# Altium schematic sheet Microprocessor.SchDoc
size B; SheetNumber: 2; SheetTotal: 2
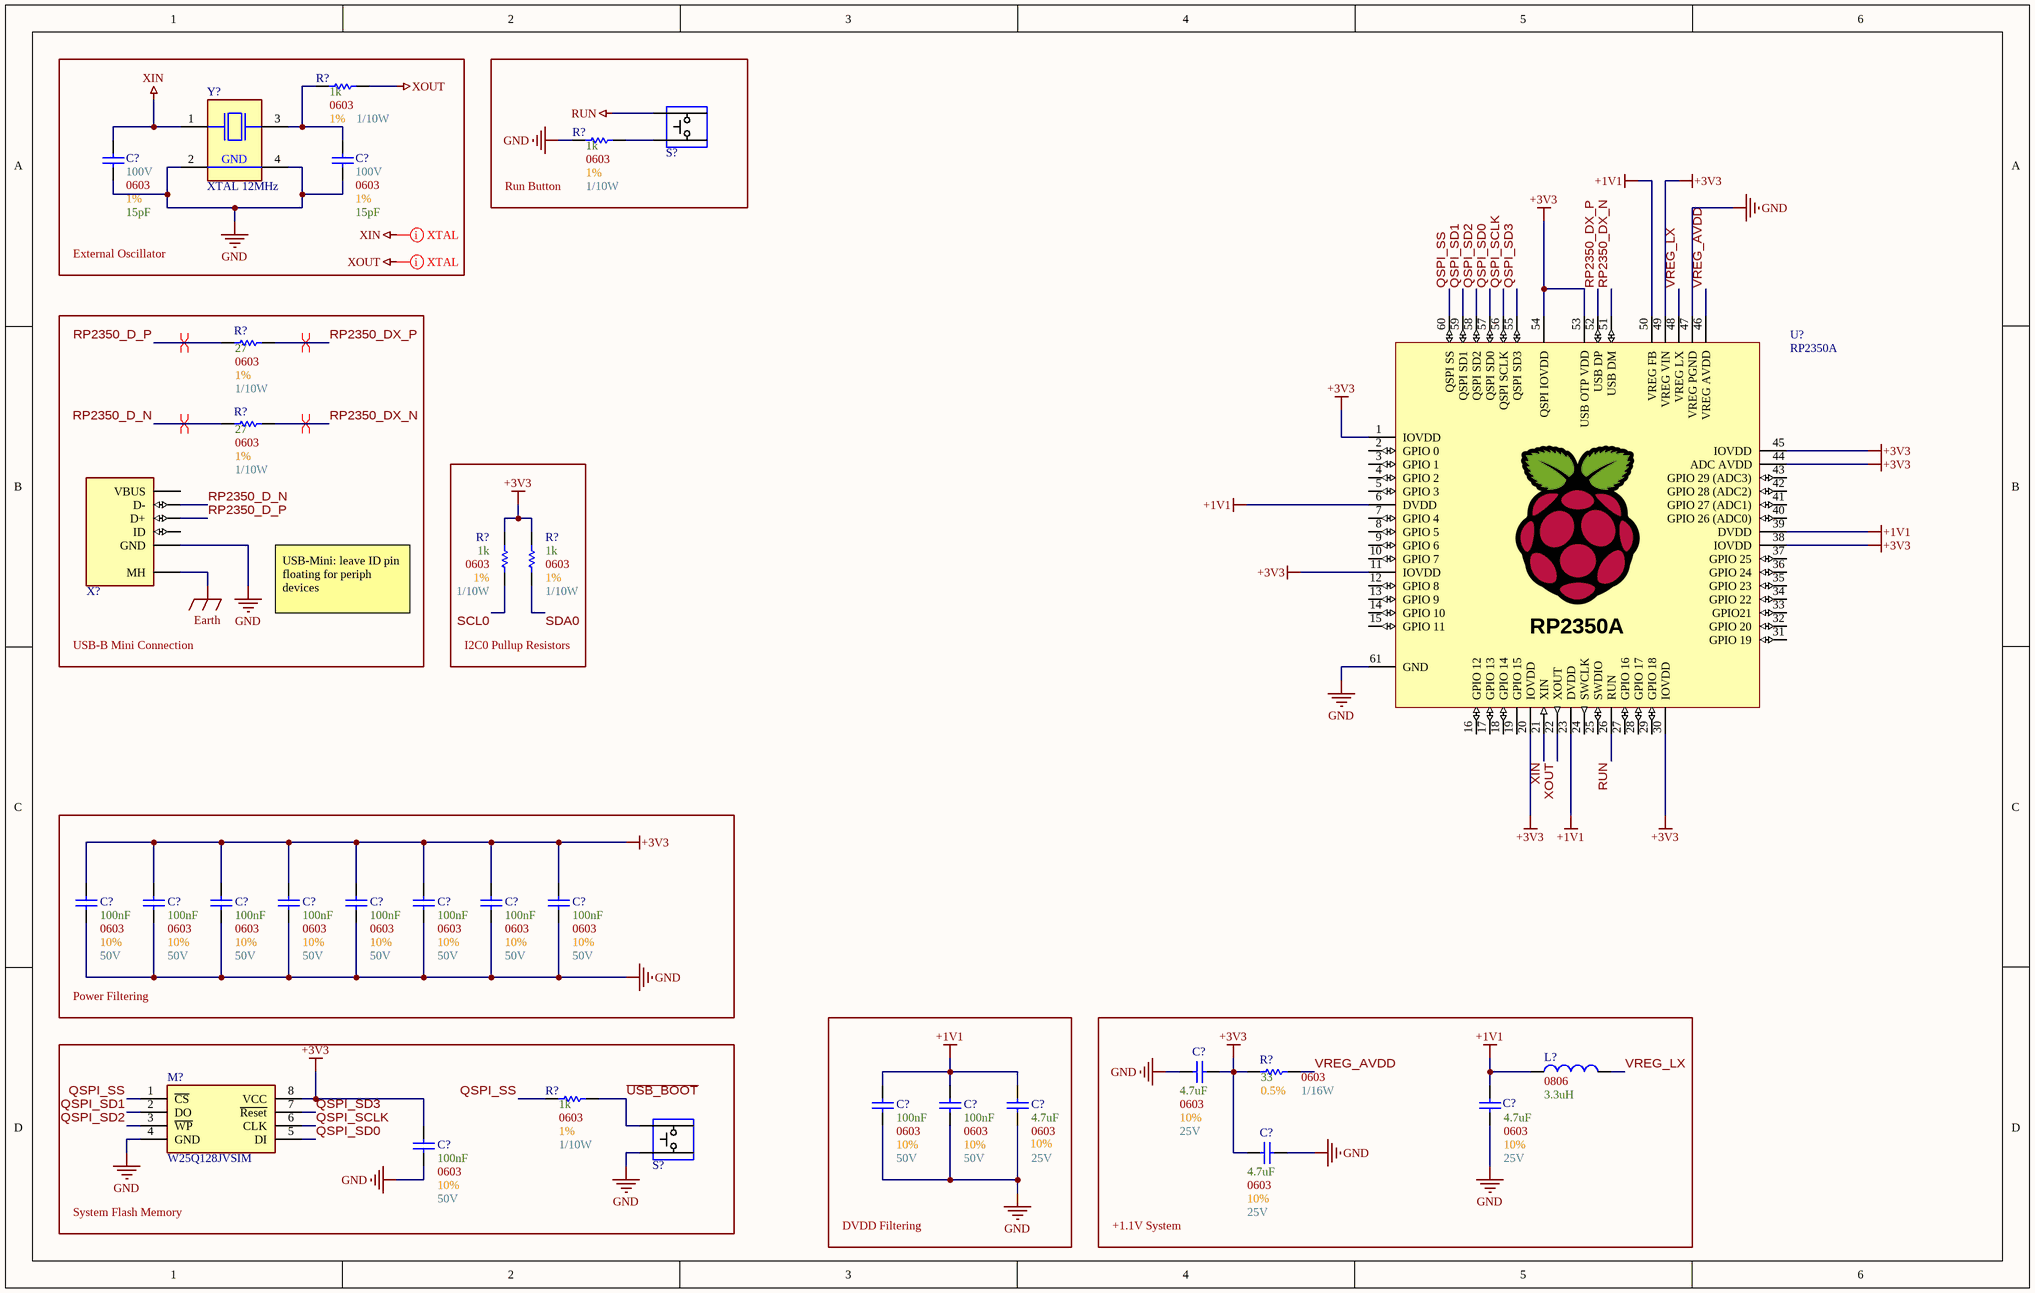
[diagram p0: Microprocessor.SchDoc]

## Parts
(Parts that share a designator on the sheet are numbered #1, #2 ... from top to bottom, then left to right.)
C?#1  Max Voltage: 100V  Size Package: 0603  Tolerance: 1%  Capacitance: 15pF  [[Cap] SMD 0603]  (hidden comment: [Cap] 0603 15pF 1% 100V)
C?#2  Max Voltage: 100V  Size Package: 0603  Tolerance: 1%  Capacitance: 15pF  [[Cap] SMD 0603]  (hidden comment: [Cap] 0603 15pF 1% 100V)
C?#3  Max Voltage: 50V  Size Package: 0603  Tolerance: 10%  Capacitance: 100nF  [[Cap] SMD 0603]  (hidden comment: [Cap] 0603 0.1uF 10% 50V)
C?#4  Max Voltage: 50V  Size Package: 0603  Tolerance: 10%  Capacitance: 100nF  [[Cap] SMD 0603]  (hidden comment: [Cap] 0603 0.1uF 10% 50V)
C?#5  Max Voltage: 50V  Size Package: 0603  Tolerance: 10%  Capacitance: 100nF  [[Cap] SMD 0603]  (hidden comment: [Cap] 0603 0.1uF 10% 50V)
C?#6  Max Voltage: 50V  Size Package: 0603  Tolerance: 10%  Capacitance: 100nF  [[Cap] SMD 0603]  (hidden comment: [Cap] 0603 0.1uF 10% 50V)
C?#7  Max Voltage: 50V  Size Package: 0603  Tolerance: 10%  Capacitance: 100nF  [[Cap] SMD 0603]  (hidden comment: [Cap] 0603 0.1uF 10% 50V)
C?#8  Max Voltage: 50V  Size Package: 0603  Tolerance: 10%  Capacitance: 100nF  [[Cap] SMD 0603]  (hidden comment: [Cap] 0603 0.1uF 10% 50V)
C?#9  Max Voltage: 50V  Size Package: 0603  Tolerance: 10%  Capacitance: 100nF  [[Cap] SMD 0603]  (hidden comment: [Cap] 0603 0.1uF 10% 50V)
C?#10  Max Voltage: 50V  Size Package: 0603  Tolerance: 10%  Capacitance: 100nF  [[Cap] SMD 0603]  (hidden comment: [Cap] 0603 0.1uF 10% 50V)
C?#11  Max Voltage: 25V  Size Package: 0603  Tolerance: 10%  Capacitance: 4.7uF  [[Cap] SMD 0603]  (hidden comment: [Cap] 0603 4.7uF 10% 25V)
C?#12  Max Voltage: 25V  Size Package: 0603  Tolerance: 10%  Capacitance: 4.7uF  [[Cap] SMD 0603]  (hidden comment: [Cap] 0603 4.7uF 10% 25V)
C?#13  Max Voltage: 50V  Size Package: 0603  Tolerance: 10%  Capacitance: 100nF  [[Cap] SMD 0603]  (hidden comment: [Cap] 0603 0.1uF 10% 50V)
C?#14  Max Voltage: 50V  Size Package: 0603  Tolerance: 10%  Capacitance: 100nF  [[Cap] SMD 0603]  (hidden comment: [Cap] 0603 0.1uF 10% 50V)
C?#15  Max Voltage: 25V  Size Package: 0603  Tolerance: 10%  Capacitance: 4.7uF  [[Cap] SMD 0603]  (hidden comment: [Cap] 0603 4.7uF 10% 25V)
C?#16  Max Voltage: 25V  Size Package: 0603  Tolerance: 10%  Capacitance: 4.7uF  [[Cap] SMD 0603]  (hidden comment: [Cap] 0603 4.7uF 10% 25V)
C?#17  Max Voltage: 50V  Size Package: 0603  Tolerance: 10%  Capacitance: 100nF  [[Cap] SMD 0603]  (hidden comment: [Cap] 0603 0.1uF 10% 50V)
L?  Package: 0806  Inductance: 3.3uH  [[Inductor] SMD 0806]  (hidden comment: [3.3uH] SMD 0806 2.1A)
M?  W25Q128JVSIM  [[Flash] 128MBit]
R?#1  Wattage: 1/10W  Tolerance: 1%  Resistance: 1k  Size Package: 0603  [[Res] SMD 0603]  (hidden comment: [1k] SMD 0603 1% 1/10W)
R?#2  Wattage: 1/10W  Tolerance: 1%  Resistance: 1k  Size Package: 0603  [[Res] SMD 0603]  (hidden comment: [1k] SMD 0603 1% 1/10W)
R?#3  Wattage: 1/10W  Tolerance: 1%  Resistance: 27  Size Package: 0603  [[Res] SMD 0603]  (hidden comment: [27] SMD 0603 1% 1/10W)
R?#4  Wattage: 1/10W  Tolerance: 1%  Resistance: 27  Size Package: 0603  [[Res] SMD 0603]  (hidden comment: [27] SMD 0603 1% 1/10W)
R?#5  Wattage: 1/10W  Tolerance: 1%  Resistance: 1k  Size Package: 0603  [[Res] SMD 0603]  (hidden comment: [1k] SMD 0603 1% 1/10W)
R?#6  Wattage: 1/10W  Tolerance: 1%  Resistance: 1k  Size Package: 0603  [[Res] SMD 0603]  (hidden comment: [1k] SMD 0603 1% 1/10W)
R?#7  Wattage: 1/16W  Tolerance: 0.5%  Resistance: 33  Size Package: 0603  [[Res] SMD 0603]  (hidden comment: [33] SMD 0603 0.5% 1/16W)
R?#8  Wattage: 1/10W  Tolerance: 1%  Resistance: 1k  Size Package: 0603  [[Res] SMD 0603]  (hidden comment: [1k] SMD 0603 1% 1/10W)
S?#1  Standard pushbutton  [[SPST] Pushbutton]  (value not drawn)
S?#2  Standard pushbutton  [[SPST] Pushbutton]  (value not drawn)
U?  RP2350A  [[MCU] RP2350A]
X?  [USB] Type-B Mini  [[USB] Type-B Mini]  (value not drawn)
Y?  XTAL 12MHz  [[Crystal] SMD 12MHz]

## Blocks framed on the sheet
External Oscillator: C?#1 C?#2 R?#1 Y?
Run Button: R?#2 S?#1
USB-B Mini Connection: R?#3 R?#4 X?
I2C0 Pullup Resistors: R?#5 R?#6
Power Filtering: C?#3-C?#10
DVDD Filtering: C?#13-C?#15
+1.1V System: C?#11 C?#12 C?#16 L? R?#7
System Flash Memory: C?#17 M? R?#8 S?#2

## Nets
+1V1: C?#12.1 C?#13.2 C?#14.2 C?#15.2 L?.1 U?.6(DVDD) U?.23(DVDD) U?.39(DVDD) U?.50(VREG_FB)
+3V3: C?#3.2 C?#4.2 C?#5.2 C?#6.2 C?#7.2 C?#8.2 C?#9.2 C?#10.2 C?#11.1 C?#16.2 C?#17.2 M?.8(VCC) R?#5.2 R?#6.2 R?#7.1 U?.1(IOVDD) U?.11(IOVDD) U?.20(IOVDD) U?.30(IOVDD) U?.38(IOVDD) U?.44(ADC_AVDD) U?.45(IOVDD) U?.49(VREG_VIN) U?.53(USB_OTP_VDD) U?.54(QSPI_IOVDD)
Earth: X?.MH
GND: C?#1.1 C?#2.1 C?#3.1 C?#4.1 C?#5.1 C?#6.1 C?#7.1 C?#8.1 C?#9.1 C?#10.1 C?#11.2 C?#12.2 C?#13.1 C?#14.1 C?#15.1 C?#16.1 C?#17.1 M?.4(GND) R?#2.1 S?#2.2 U?.47(VREG_PGND) U?.61(GND) X?.5(GND) Y?.2(GND) Y?.4(GND)
RUN: S?#1.1 U?.26(RUN)
XIN: C?#1.2 U?.21(XIN) Y?.1(XTAL1)
XOUT: R?#1.2 U?.22(XOUT)
QSPI_SCLK: M?.6(CLK) U?.56(QSPI_SCLK)
QSPI_SD0: M?.5(DI) U?.57(QSPI_SD0)
QSPI_SD1: M?.2(DO) U?.59(QSPI_SD1)
QSPI_SD2: M?.3(~{WP}) U?.58(QSPI_SD2)
QSPI_SD3: M?.7(~{Reset}) U?.55(QSPI_SD3)
QSPI_SS: M?.1(~{CS}) R?#8.1 U?.60(QSPI_SS)
RP2350_D_N: R?#4.1 X?.2(D-)
RP2350_D_P: R?#3.1 X?.3(D+)
RP2350_DX_N: R?#4.2 U?.51(USB_DM)
RP2350_DX_P: R?#3.2 U?.52(USB_DP)
SCL0: R?#5.1
SDA0: R?#6.1
~{USB_BOOT}: R?#8.2 S?#2.1
VREG_AVDD: R?#7.2 U?.46(VREG_AVDD)
VREG_LX: L?.2 U?.48(VREG_LX)
NetC?#2_2: C?#2.2 R?#1.1 Y?.3(XTAL2)
NetR?#2_2: R?#2.2 S?#1.2

Not connected (* = marked no-connect by the designer): U? 2(GPIO_0) 3(GPIO_1) 4(GPIO_2) 5(GPIO_3) 7(GPIO_4) 8(GPIO_5) 9(GPIO_6) 10(GPIO_7) 12(GPIO_8) 13(GPIO_9) 14(GPIO_10) 15(GPIO_11) 16(GPIO_12) 17(GPIO_13) 18(GPIO_14) 19(GPIO_15) 24(SWCLK) 25(SWDIO) 27(GPIO_16) 28(GPIO_17) 29(GPIO_18) 31(GPIO_19) 32(GPIO_20) 33(GPIO21) 34(GPIO_22) 35(GPIO_23) 36(GPIO_24) 37(GPIO_25) 40(GPIO_26_(ADC0)) 41(GPIO_27_(ADC1)) 42(GPIO_28_(ADC2)) 43(GPIO_29_(ADC3)); X? 1(VBUS) 4(ID)

## Layout directives
differential pair; differential pair class USB_Pairs: RP2350_D_N, RP2350_D_P, RP2350_DX_N, RP2350_DX_P
net class XTAL_Nets: XIN, XOUT

## Notes on the sheet
- USB-Mini: leave ID pin floating for periph devices
- Labels drawn without touching a wire or pin: XIN, XOUT

## Library data of the parts
C?#1 C?#2 = [Cap] 0603 15pF 1% 100V: GCM1885C2A150FA16D; Supplier 1: DigiKey; Supplier Part Number 1: 490-16416-1-ND
C?#3-C?#10 C?#13 C?#14 C?#17 = [Cap] 0603 0.1uF 10% 50V: CL10B104KB8NNNC; Supplier 1: DigiKey; Supplier Part Number 1: 1276-1000-6-ND
C?#11 C?#12 C?#15 C?#16 = [Cap] 0603 4.7uF 10% 25V: GRM188R61E475KE11D; Supplier 1: DigiKey; Supplier Part Number 1: 490-7203-6-ND
L? = [3.3uH] SMD 0806 2.1A: AOTA-B201610S3R3-101-T; Supplier 1: DigiKey; Supplier Part Number 1: 535-AOTA-B201610S3R3-101-TCT-ND
M? = [Flash] 128MBit: Supplier 1: DigiKey; Supplier Part Number 1: W25Q128JVSIM-ND
R?#1 R?#2 R?#5 R?#6 R?#8 = [1k] SMD 0603 1% 1/10W: RMCF0603FT1K00; Supplier 1: DigiKey; Supplier Part Number 1: RMCF0603FT1K00DKR-ND
R?#3 R?#4 = [27] SMD 0603 1% 1/10W: MCT06030C2709FP500; Supplier 1: DigiKey; Supplier Part Number 1: 749-1631-1-ND
R?#7 = [33] SMD 0603 0.5% 1/16W: RR0816Q-330-D; Supplier 1: DigiKey; Supplier Part Number 1: RR08Q33DDKR-ND
S?#1 S?#2 = [SPST] Pushbutton: Supplier 1: DigiKey; Supplier Part Number 1: 450-1650-ND
U? = [MCU] RP2350A: QFN-60 Package; Supplier 1: DigiKey; Supplier Part Number 1: 2648-SC1509-A4CT-ND
X? = [USB] Type-B Mini: MUSB-05-S-B-SM-A-K-TR; Supplier 1: DigiKey; Supplier Part Number 1: SAM14226CT-ND
Y? = [Crystal] SMD 12MHz: 815-ABM8-272-T3; Supplier 1: DigiKey; Supplier Part Number 1: 535-ABM8-272-T3CT-ND